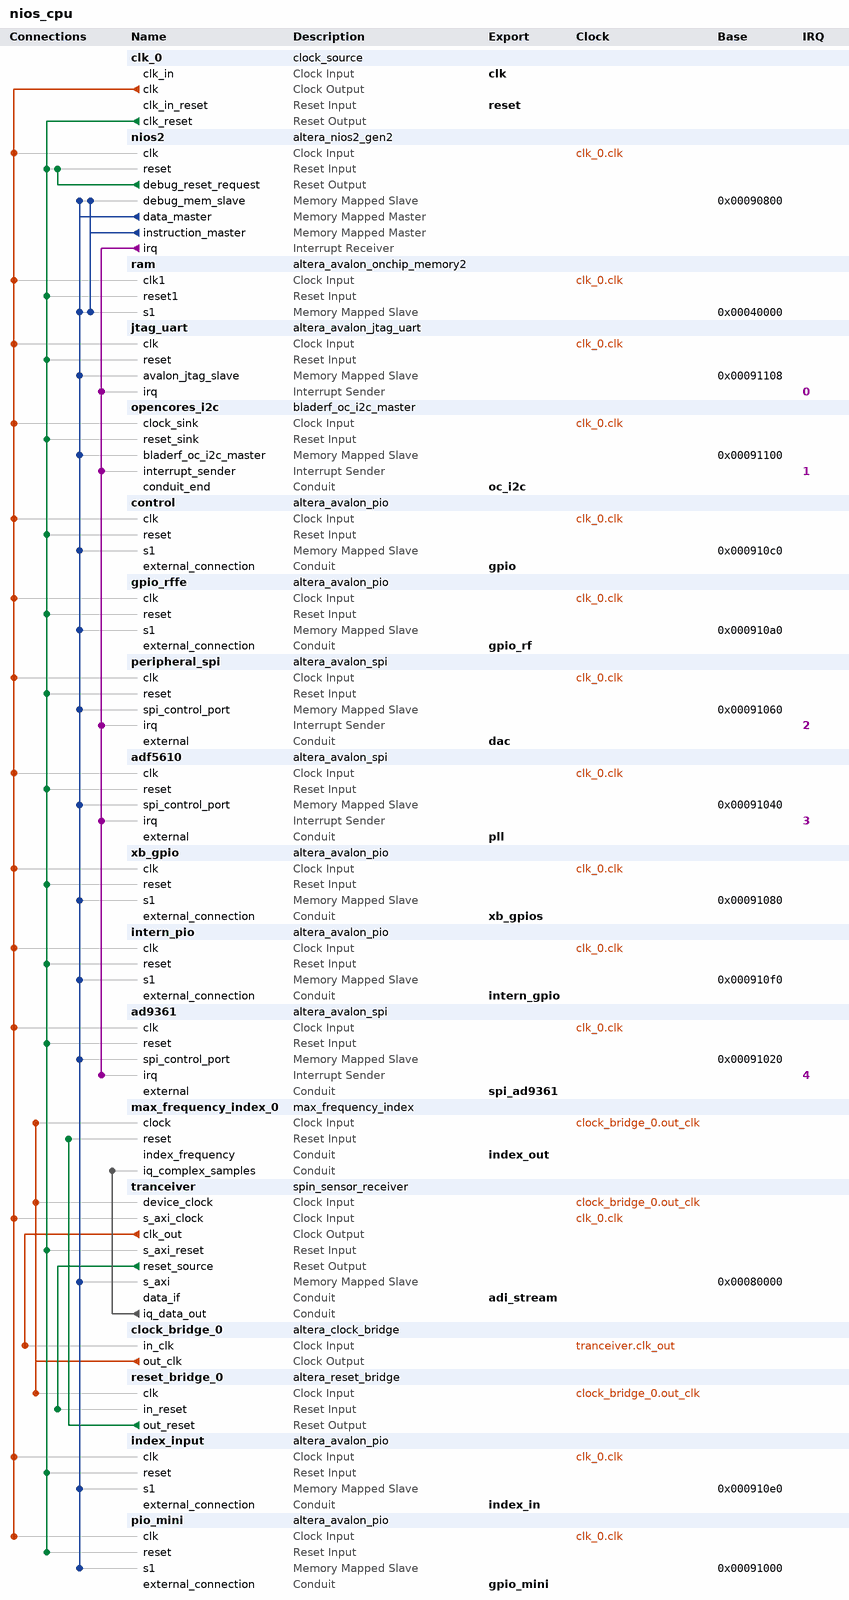
[diagram p0: system contents]
# Platform Designer (Qsys) system nios_cpu, Cyclone V 5CEBA4F23C8
# Parameters at their usual value, and those the tool derives, are not listed.
package require -exact qsys 20.1
create_system nios_cpu
set_project_property DEVICE_FAMILY {Cyclone V}
set_project_property DEVICE 5CEBA4F23C8

add_instance clk_0 clock_source 20.1
set_instance_parameter_value clk_0 clockFrequency 80000000

add_instance nios2 altera_nios2_gen2 20.1
set_instance_parameter_value nios2 dcache_size 2048
set_instance_parameter_value nios2 exceptionSlave ram.s1
set_instance_parameter_value nios2 icache_size 4096
set_instance_parameter_value nios2 impl Tiny
set_instance_parameter_value nios2 resetSlave ram.s1

add_instance ram altera_avalon_onchip_memory2 20.1
set_instance_parameter_value ram dataWidth 32
set_instance_parameter_value ram dualPort false
set_instance_parameter_value ram initMemContent false
set_instance_parameter_value ram initializationFileName onchip_mem.hex
set_instance_parameter_value ram memorySize 262144

add_instance jtag_uart altera_avalon_jtag_uart 20.1
set_instance_parameter_value jtag_uart simInteractiveOptions NO_INTERACTIVE_WINDOWS

add_instance opencores_i2c bladerf_oc_i2c_master 1.0
set_instance_parameter_value opencores_i2c ARST_LVL 1

add_instance control altera_avalon_pio 20.1
set_instance_parameter_value control bitModifyingOutReg true
set_instance_parameter_value control direction InOut
set_instance_parameter_value control width 32

add_instance gpio_rffe altera_avalon_pio 20.1
set_instance_parameter_value gpio_rffe bitModifyingOutReg true
set_instance_parameter_value gpio_rffe direction InOut
set_instance_parameter_value gpio_rffe width 32

add_instance peripheral_spi altera_avalon_spi 20.1
set_instance_parameter_value peripheral_spi clockPhase 1
set_instance_parameter_value peripheral_spi clockPolarity 1
set_instance_parameter_value peripheral_spi dataWidth 8
set_instance_parameter_value peripheral_spi masterSPI true
set_instance_parameter_value peripheral_spi numberOfSlaves 2
set_instance_parameter_value peripheral_spi targetClockRate 9600000

add_instance adf5610 altera_avalon_spi 20.1
set_instance_parameter_value adf5610 clockPhase 1
set_instance_parameter_value adf5610 clockPolarity 1
set_instance_parameter_value adf5610 dataWidth 8
set_instance_parameter_value adf5610 insertDelayBetweenSlaveSelectAndSClk true
set_instance_parameter_value adf5610 masterSPI true
set_instance_parameter_value adf5610 numberOfSlaves 1
set_instance_parameter_value adf5610 targetClockRate 40000000
set_instance_parameter_value adf5610 targetSlaveSelectToSClkDelay 5.0

add_instance xb_gpio altera_avalon_pio 20.1
set_instance_parameter_value xb_gpio bitModifyingOutReg true
set_instance_parameter_value xb_gpio direction Input
set_instance_parameter_value xb_gpio width 8

add_instance intern_pio altera_avalon_pio 20.1
set_instance_parameter_value intern_pio direction Input
set_instance_parameter_value intern_pio width 8

add_instance ad9361 altera_avalon_spi 20.1
set_instance_parameter_value ad9361 clockPolarity 1
set_instance_parameter_value ad9361 dataWidth 8
set_instance_parameter_value ad9361 masterSPI true
set_instance_parameter_value ad9361 numberOfSlaves 1
set_instance_parameter_value ad9361 targetClockRate 40000000
set_instance_parameter_value ad9361 targetSlaveSelectToSClkDelay 3.0

add_instance max_frequency_index_0 max_frequency_index 1.0

add_instance tranceiver spin_sensor_receiver 1.0
set_instance_parameter_value tranceiver FPGA_TECHNOLOGY CYCLONE5

add_instance clock_bridge_0 altera_clock_bridge 20.1
set_instance_parameter_value clock_bridge_0 DERIVED_CLOCK_RATE 0
set_instance_parameter_value clock_bridge_0 EXPLICIT_CLOCK_RATE 0

add_instance reset_bridge_0 altera_reset_bridge 20.1
set_instance_parameter_value reset_bridge_0 ACTIVE_LOW_RESET 0
set_instance_parameter_value reset_bridge_0 SYNCHRONOUS_EDGES deassert

add_instance index_input altera_avalon_pio 20.1
set_instance_parameter_value index_input direction Input
set_instance_parameter_value index_input width 8

add_instance pio_mini altera_avalon_pio 20.1
set_instance_parameter_value pio_mini bitModifyingOutReg true
set_instance_parameter_value pio_mini direction Output
set_instance_parameter_value pio_mini width 8

# connections
add_connection clk_0.clk ad9361.clk clock
add_connection clk_0.clk adf5610.clk clock
add_connection clk_0.clk control.clk clock
add_connection clk_0.clk gpio_rffe.clk clock
add_connection clk_0.clk index_input.clk clock
add_connection clk_0.clk intern_pio.clk clock
add_connection clk_0.clk jtag_uart.clk clock
add_connection clk_0.clk nios2.clk clock
add_connection clk_0.clk opencores_i2c.clock_sink clock
add_connection clk_0.clk peripheral_spi.clk clock
add_connection clk_0.clk pio_mini.clk clock
add_connection clk_0.clk ram.clk1 clock
add_connection clk_0.clk tranceiver.s_axi_clock clock
add_connection clk_0.clk xb_gpio.clk clock
add_connection clock_bridge_0.out_clk max_frequency_index_0.clock clock
add_connection clock_bridge_0.out_clk reset_bridge_0.clk clock
add_connection clock_bridge_0.out_clk tranceiver.device_clock clock
add_connection tranceiver.clk_out clock_bridge_0.in_clk clock
add_connection clk_0.clk_reset ad9361.reset reset
add_connection clk_0.clk_reset adf5610.reset reset
add_connection clk_0.clk_reset control.reset reset
add_connection clk_0.clk_reset gpio_rffe.reset reset
add_connection clk_0.clk_reset index_input.reset reset
add_connection clk_0.clk_reset intern_pio.reset reset
add_connection clk_0.clk_reset jtag_uart.reset reset
add_connection clk_0.clk_reset nios2.reset reset
add_connection clk_0.clk_reset opencores_i2c.reset_sink reset
add_connection clk_0.clk_reset peripheral_spi.reset reset
add_connection clk_0.clk_reset pio_mini.reset reset
add_connection clk_0.clk_reset ram.reset1 reset
add_connection clk_0.clk_reset tranceiver.s_axi_reset reset
add_connection clk_0.clk_reset xb_gpio.reset reset
add_connection nios2.debug_reset_request nios2.reset reset
add_connection reset_bridge_0.out_reset max_frequency_index_0.reset reset
add_connection tranceiver.reset_source reset_bridge_0.in_reset reset
add_connection nios2.data_master ad9361.spi_control_port avalon
set_connection_parameter_value nios2.data_master/ad9361.spi_control_port baseAddress 0x00091020
add_connection nios2.data_master adf5610.spi_control_port avalon
set_connection_parameter_value nios2.data_master/adf5610.spi_control_port baseAddress 0x00091040
add_connection nios2.data_master control.s1 avalon
set_connection_parameter_value nios2.data_master/control.s1 baseAddress 0x000910c0
add_connection nios2.data_master gpio_rffe.s1 avalon
set_connection_parameter_value nios2.data_master/gpio_rffe.s1 baseAddress 0x000910a0
add_connection nios2.data_master index_input.s1 avalon
set_connection_parameter_value nios2.data_master/index_input.s1 baseAddress 0x000910e0
add_connection nios2.data_master intern_pio.s1 avalon
set_connection_parameter_value nios2.data_master/intern_pio.s1 baseAddress 0x000910f0
add_connection nios2.data_master jtag_uart.avalon_jtag_slave avalon
set_connection_parameter_value nios2.data_master/jtag_uart.avalon_jtag_slave baseAddress 0x00091108
add_connection nios2.data_master nios2.debug_mem_slave avalon
set_connection_parameter_value nios2.data_master/nios2.debug_mem_slave baseAddress 0x00090800
add_connection nios2.data_master opencores_i2c.bladerf_oc_i2c_master avalon
set_connection_parameter_value nios2.data_master/opencores_i2c.bladerf_oc_i2c_master baseAddress 0x00091100
add_connection nios2.data_master peripheral_spi.spi_control_port avalon
set_connection_parameter_value nios2.data_master/peripheral_spi.spi_control_port baseAddress 0x00091060
add_connection nios2.data_master pio_mini.s1 avalon
set_connection_parameter_value nios2.data_master/pio_mini.s1 baseAddress 0x00091000
add_connection nios2.data_master ram.s1 avalon
set_connection_parameter_value nios2.data_master/ram.s1 baseAddress 0x00040000
add_connection nios2.data_master tranceiver.s_axi avalon
set_connection_parameter_value nios2.data_master/tranceiver.s_axi baseAddress 0x00080000
add_connection nios2.data_master xb_gpio.s1 avalon
set_connection_parameter_value nios2.data_master/xb_gpio.s1 baseAddress 0x00091080
add_connection nios2.instruction_master nios2.debug_mem_slave avalon
set_connection_parameter_value nios2.instruction_master/nios2.debug_mem_slave baseAddress 0x00090800
add_connection nios2.instruction_master ram.s1 avalon
set_connection_parameter_value nios2.instruction_master/ram.s1 baseAddress 0x00040000
add_connection tranceiver.iq_data_out max_frequency_index_0.iq_complex_samples conduit
add_connection nios2.irq ad9361.irq interrupt
set_connection_parameter_value nios2.irq/ad9361.irq irqNumber 4
add_connection nios2.irq adf5610.irq interrupt
set_connection_parameter_value nios2.irq/adf5610.irq irqNumber 3
add_connection nios2.irq jtag_uart.irq interrupt
set_connection_parameter_value nios2.irq/jtag_uart.irq irqNumber 0
add_connection nios2.irq opencores_i2c.interrupt_sender interrupt
set_connection_parameter_value nios2.irq/opencores_i2c.interrupt_sender irqNumber 1
add_connection nios2.irq peripheral_spi.irq interrupt
set_connection_parameter_value nios2.irq/peripheral_spi.irq irqNumber 2

# exported interfaces
add_interface adi_stream conduit end
set_interface_property adi_stream EXPORT_OF tranceiver.data_if
add_interface clk clock sink
set_interface_property clk EXPORT_OF clk_0.clk_in
add_interface dac conduit end
set_interface_property dac EXPORT_OF peripheral_spi.external
add_interface gpio conduit end
set_interface_property gpio EXPORT_OF control.external_connection
add_interface gpio_mini conduit end
set_interface_property gpio_mini EXPORT_OF pio_mini.external_connection
add_interface gpio_rf conduit end
set_interface_property gpio_rf EXPORT_OF gpio_rffe.external_connection
add_interface index_in conduit end
set_interface_property index_in EXPORT_OF index_input.external_connection
add_interface index_out conduit end
set_interface_property index_out EXPORT_OF max_frequency_index_0.index_frequency
add_interface intern_gpio conduit end
set_interface_property intern_gpio EXPORT_OF intern_pio.external_connection
add_interface oc_i2c conduit end
set_interface_property oc_i2c EXPORT_OF opencores_i2c.conduit_end
add_interface pll conduit end
set_interface_property pll EXPORT_OF adf5610.external
add_interface reset reset sink
set_interface_property reset EXPORT_OF clk_0.clk_in_reset
add_interface spi_ad9361 conduit end
set_interface_property spi_ad9361 EXPORT_OF ad9361.external
add_interface xb_gpios conduit end
set_interface_property xb_gpios EXPORT_OF xb_gpio.external_connection

set_interconnect_requirement {$system} qsys_mm.clockCrossingAdapter HANDSHAKE
set_interconnect_requirement {$system} qsys_mm.enableEccProtection FALSE
set_interconnect_requirement {$system} qsys_mm.insertDefaultSlave FALSE
set_interconnect_requirement {$system} qsys_mm.maxAdditionalLatency 1

save_system nios_cpu.qsys
